# Altium schematic sheet Power_section.SchDoc
size A4; SheetNumber: 2; SheetTotal: 3
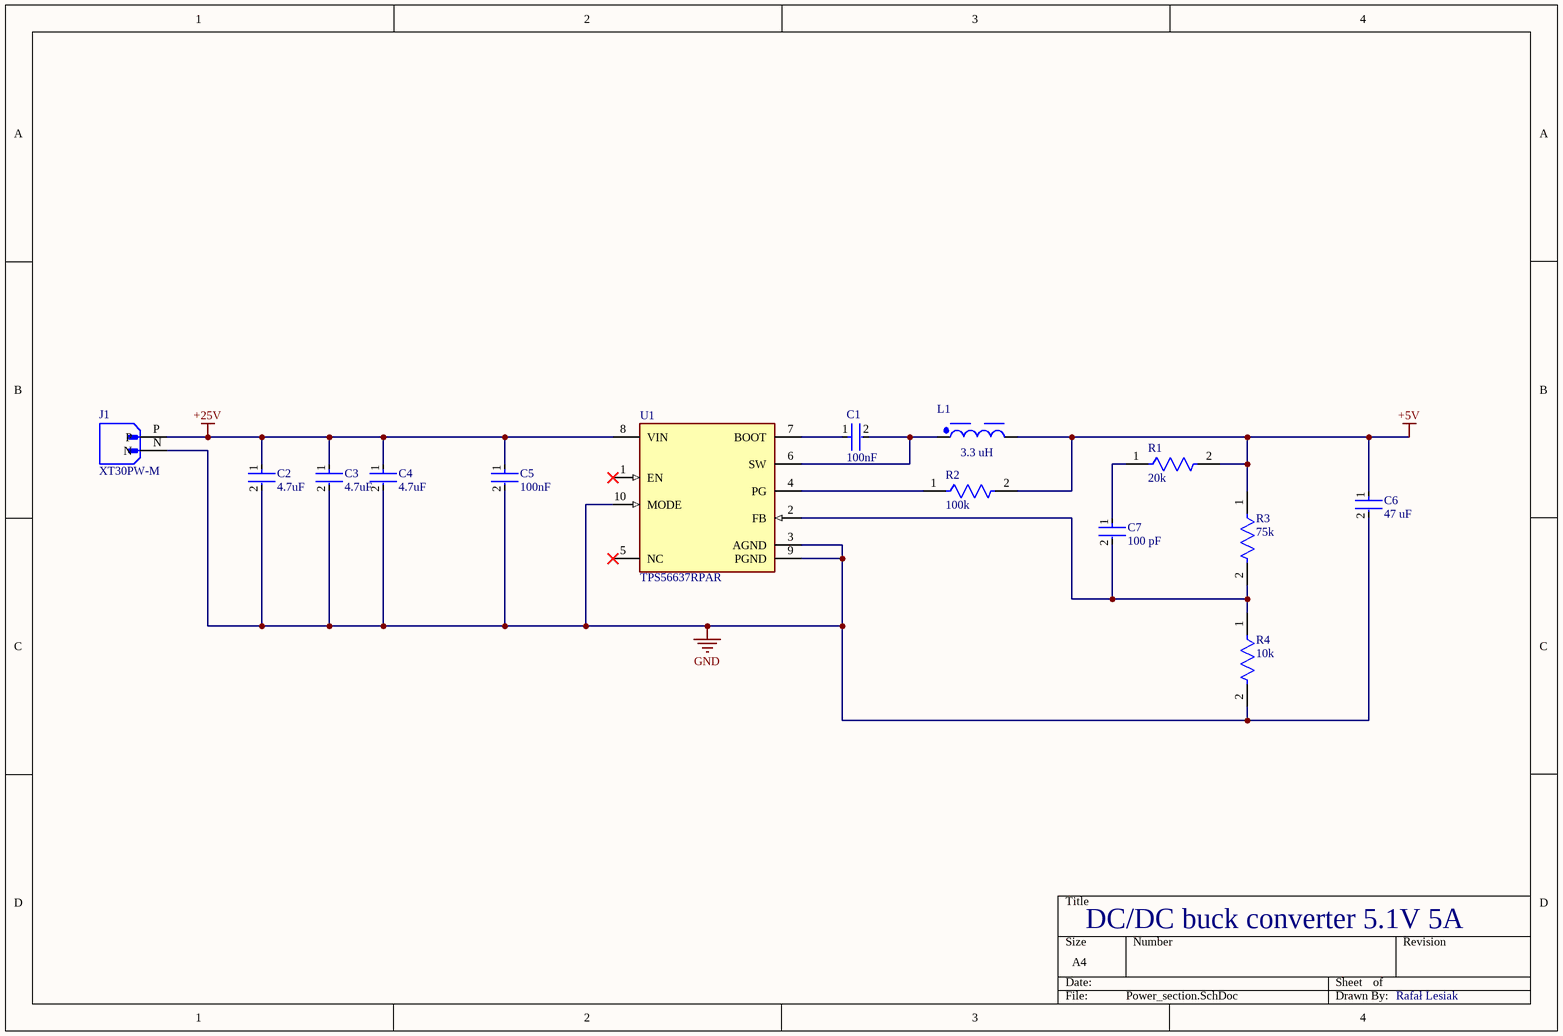
[diagram p0: Power_section.SchDoc]

## Parts
C1  100nF  [FP-GRM188-0_1-e0_2_0_5-MFG]
C2  4.7uF  [FP-CC0805-0_85-MFG]
C3  4.7uF  [FP-CC0805-0_85-MFG]
C4  4.7uF  [FP-CC0805-0_85-MFG]
C5  100nF  [FP-GRM188-0_1-e0_2_0_5-MFG]
C6  47 uF  [FP-GRM32E-0_3-0_2-IPC_C]
C7  100 pF  [FP-C0201-AB-MFG]
J1  XT30PW-M  [AMASS_XT30PW-M]
L1  3.3 uH  [WE-PD_1260P]
R1  20k  [FP-AC0402-IPC_A]
R2  100k  [FP-CRCW0402-e3-IPC_C]
R3  75k  [FP-CR0402-IPC_C]
R4  10k  [FP-AC0402-IPC_C]
U1  TPS56637RPAR  [FP-RPA0010A-MFG]

## Nets
+5V: C6.1 L1.2 R1.2 R2.2 R3.1
+25V: C2.1 C3.1 C4.1 C5.1 J1.P U1.8(VIN)
GND: C2.2 C3.2 C4.2 C5.2 C6.2 J1.N R4.2 U1.3(AGND) U1.9(PGND) U1.10(MODE)
NetC1_1: C1.1 U1.7(BOOT)
NetC1_2: C1.2 L1.1 U1.6(SW)
NetC7_1: C7.1 R1.1
NetC7_2: C7.2 R3.2 R4.1 U1.2(FB)
NetR2_1: R2.1 U1.4(PG)

Not connected (* = marked no-connect by the designer): U1 1(EN)* 5(NC)*

## Notes on the sheet
- DC/DC buck converter 5.1V 5A
- Rafał Lesiak

## Library data of the parts
C1 C5 = CMP-06035-031811-1: Chip Multilayer Ceramic Capacitors for General Purpose, 0603, 0.10uF, X7R, 15%, 20%, 100V; Capacitance: 100nF; Thickness: 800um; Tolerance: 20%; Voltage Rating (DC): 100V; Length: 1.6mm; Width: 800um; Dielectric: X7R
C2-C4 = CMP-03422-000966-1: CAP CER 4.7UF 50V X5R 0805; Manufacturer: Yageo; Manufacturer Part Number: CC0805KKX5R9BB475; Tolerance: 0.1; Material: Ceramic; Capacitance: 4.7 uF; Value: 4.7 uF; Height: 0.95mm; Category: Cap; ComponentLink2Description: Datasheet; Lead Free: Yes; Voltage Rating: 50 V; Device Class L2: Capacitors; Temperature Range High: +85°C; ComponentLink2URL: http://www.yageo.com/documents/recent/UPY-GPHC_Y5V_6.3V-to-50V_8.pdf; Ipc Land Pattern Name: CAPC200125X85; Octopart: https://octopart.com/cc0805kkx5r9bb475-yageo-81932641; Temperature Range Low: -30°C; Digikey Description: CAP CER 4.7UF 50V X5R 0805; Package: CC0805-0.85; Device Class L1: Passive Components; RoHS: TRUE; Temperature Characteristic: X5R; Device Class L3: Ceramic Capacitors; Automotive: No; Temperature: -30°C to +85°C; Footprint Url: http://www.yageo.com/exep/pages/download/literatures/UPY-C_GEN_24.pdf
C6 = CMP-2000-06362-2: CAP CER 47UF 16V X5R 1210; Tolerance: 10%; Material: Ceramic; Case Code (Metric): 3225; RoHS Compliant: Yes; Min Operating Temperature: -55°C; Radiation Hardening: No; Voltage: 16V; Package Quantity: 1; Case Code (Imperial): 1210; REACH SVHC: No SVHC; Capacitance: 47uF; Voltage Rating (DC): 16V; Dielectric: X5R; Case/Package: 1210; Length: 3.2mm; Voltage Rating: 16V; Packaging: Cut Tape; Width: 0.098inch; Number of Pins: 2; Lead Free: Lead Free; Height: 2.5mm; Mount: Surface Mount; Termination: SMD/SMT; Max Operating Temperature: 85°C; Thickness: 0.106inch; Depth: 2.5mm
C7 = CMP-03020-034480-1: CAP CER 100PF 25V 5% NP0 0201; Manufacturer: KEMET; Manufacturer Part Number: C0201C101K3GACTU; Standoff Height: 0mm; Temperature Coefficient: 30ppm/°C; Tolerance: 0.1; Temperature Characteristic: C0G; Material: Ceramic; Value: 100 pF; Package: C0201-AB; Device Class L1: Passive Components; Device Class L3: Ceramic Capacitors; Automotive: No; Temperature Range Low: -55°C; Temperature Range High: +125°C; Octopart: https://octopart.com/c0201c101k3gactu-kemet-17054818; Ipc Land Pattern Name: CAPC6030X30; ComponentLink2URL: https://content.kemet.com/datasheets/KEM_C1003_C0G_SMD.pdf; Height: 0.33mm; Voltage Rating: 25 V; Lead Free: Yes; ComponentLink2Description: Datasheet; Digikey Description: CAP CER 100PF 25V 5% NP0 0201; Device Class L2: Capacitors; Capacitance: 100 pF; Temperature: -55°C to +125°C; Mouser Description: Multilayer Ceramic Capacitors MLCC - SMD/SMT 25volts 100pF C0G 10%; Category: Cap; RoHS: TRUE
J1 = XT30PW-M: Socket; DC supply; XT30; male; PIN: 2; on PCBs; THT; Colour: yellow; MF: AMASS; SnapEDA_Link: https://www.snapeda.com/parts/XT30PW-M/AMASS/view-part/?ref=snap; Package: None; Value: *; MP: XT30PW-M; Check_prices: https://www.snapeda.com/parts/XT30PW-M/AMASS/view-part/?ref=eda
L1 = CMP-207846-000022-3: Inductor, Aec-Q200, 3.3Uh, Shld, 9.2A Rohs Compliant: Yes; Series Resistance: 10mΩ; DC Resistance (DCR): 7.5mΩ; Self Resonant Frequency: 32.2MHz; Tolerance: 30%; Inductance: 3.3µH; Test Frequency: 100kHz; Saturation Current: 13.5A; Width: 12mm; RMS Current (Irms): 9.2A; Length: 12mm; Height: 6mm; Min Operating Temperature: -40°C; RoHS: Compliant; Ambient Temperature Range High: 110°C; Current Rating: 9.2A; Composition: Wirewound; Max Operating Temperature: 150°C; Ambient Temperature Range Low: -40°C
R1 = CMP-03412-040395-1: RES 20kΩ ±1% 0.125W 0402
R2 = CMP-2002-08123-3: RES Thick Film, 100kΩ, 1%, 0.063W, 100ppm/°C, 0402; Power Rating: 63mW; Resistance: 100kR; Voltage Rating (DC): 50V; Lead Free: Lead Free; Height: 0.35mm; Contact Plating: Tin; Min Operating Temperature: -55°C; Package Quantity: 10000; Case/Package: 0402; Temperature Coefficient: 100ppm/°C; Number of Terminations: 2; Packaging: Tape and Reel; Max Power Dissipation: 63mW; Case Code (Metric): 1005; Mount: Surface Mount; Width: 0.02inch; Termination: SMD/SMT; Length: 1mm; Number of Pins: 2; Weight: 2.3E-05oz; Radiation Hardening: No; Tolerance: 1%; Military Standard: Not; Features: Automotive AEC-Q200; Depth: 0.5mm; Composition: Thick Film; Max Operating Temperature: 155°C; Voltage Rating: 50V; Case Code (Imperial): 0402
R3 = CMP-2002-05392-2: Thick Film Chip Resistors 0402 75kΩ 0.0625W 1% 100ppm/°C; Max Power Dissipation: 63mW; Voltage Rating: 50V; Power Rating: 62.5mW; Resistance: 75kR; Min Operating Temperature: -55°C; Max Operating Temperature: 125°C; Mount: Surface Mount; Radiation Hardening: No; Depth: 0.5mm; Case Code (Imperial): 0402; Length: 1mm; Number of Terminations: 2; Case Code (Metric): 1005; Case/Package: 0402; Package Quantity: 10000; Temperature Coefficient: 100ppm/°C; Contact Plating: Tin; Composition: Thick Film; Thickness: 356um; Termination: SMD/SMT; Tolerance: 1%; Packaging: Tape and Reel; Width: 0.5mm; Height: 0.016inch; Military Standard: Not
R4 = CMP-03412-044365-1: RES 10kΩ ±1% 0.125W 0402; RoHS Compliant: Yes
U1 = CMP-04918-000008-1: IC POWER MANAGEMENT; Manufacturer: Texas Instruments; Max Duty Cycle: 91%; Nominal Supply Current: 140uA; Max Supply Voltage: 28V; Output Current: 6A; Switching Frequency: 500kHz; Output Type: AdjustableProgrammable; Max Junction Temp: +150°C; Output Voltage: 0.6-13V; Switching Topology: Buck; Standoff Height: 0mm; Number Of Outputs: 1; Min Supply Voltage: 4.5V; Automotive: No; Manufacturer Part Number: TPS56637RPAR; Lead Free: Yes; Temperature Range Low: -40°C; Digikey Description: IC POWER MANAGEMENT; Octopart: https://octopart.com/tps56637rpar-texas+instruments-97650653; Temperature: -40°C to +150°C; Device Class L3: Voltage Regulators - Switching; Temperature Range High: +150°C; Package: RPA0010A; Device Class L2: Power Management ICs; ComponentLink2URL: http://www.ti.com/lit/ds/symlink/tps56637.pdf; Device Class L1: Integrated Circuits (ICs); RoHS: TRUE; ComponentLink2Description: Datasheet; Height: 1mm; Category: IC